# EAGLE design 27c322adapter_3_2 (EAGLE 7.5.0)
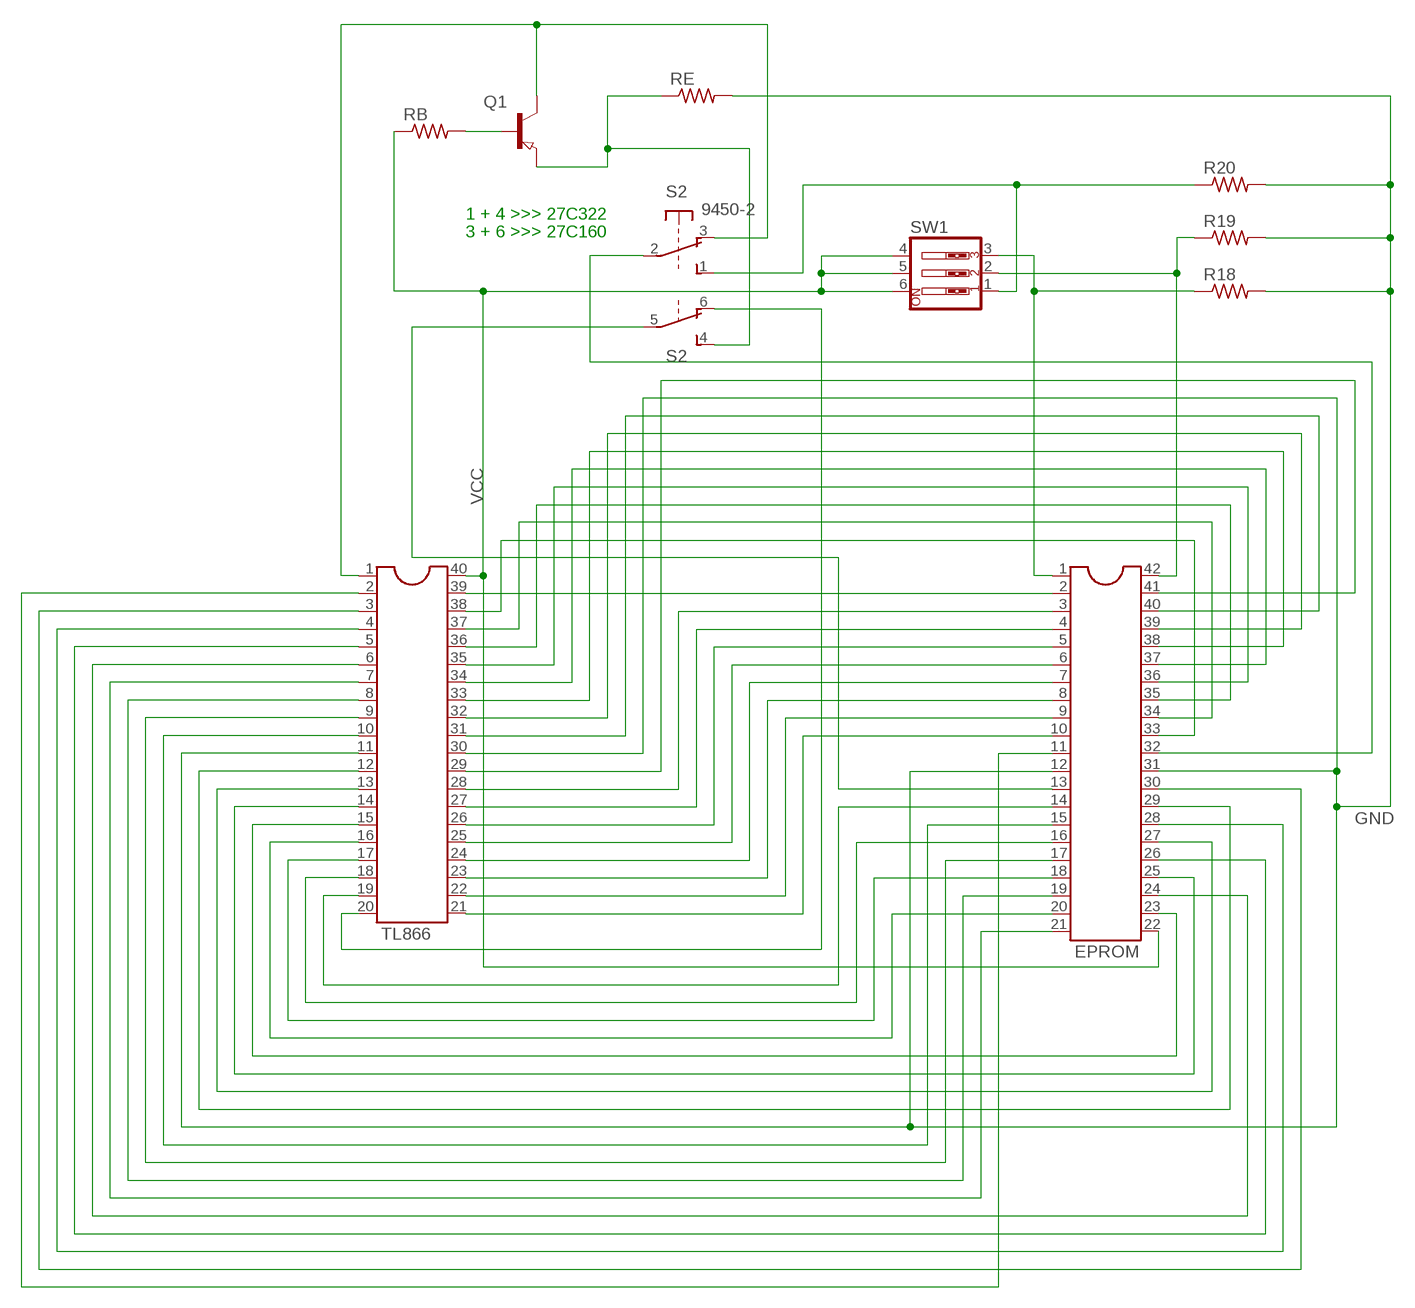
[diagram p0: schematic, sheet 1]

## Parts
IC1  EPROM  DIL42_SLIM  [DIL42_SLIM]
Q1  PNP-TRANSISTOR_SOT23  [SOT23]
R18  R-US_R0805  [R0805]
R19  R-US_R0805  [R0805]
R20  R-US_R0805  [R0805]
RB  R-US_R0805  [R0805]
RE  R-US_R0805  [R0805]
S2  9450-2  [9450-2]
SW1  SW_DIP-3  [EDG-03]
TL866  TL866  DIL40_SLIM  [DIL40_SLIM]

## Nets
GND: IC1.12 IC1.31 R18.2 R19.2 R20.2 RE.2 TL866.11 TL866.30
N$1: IC1.32 S2.2(1:P)
N$2: IC1.2 TL866.39
N$3: IC1.33 TL866.38
N$4: IC1.34 TL866.37
N$5: IC1.35 TL866.36
N$6: IC1.36 TL866.35
N$7: IC1.37 TL866.34
N$8: IC1.38 TL866.33
N$9: IC1.39 TL866.32
N$10: IC1.40 TL866.31
N$11: IC1.42 R19.1 SW1.2
N$12: IC1.41 TL866.29
N$13: IC1.3 TL866.28
N$14: IC1.4 TL866.27
N$15: IC1.5 TL866.26
N$16: IC1.6 TL866.25
N$17: IC1.7 TL866.24
N$18: IC1.8 TL866.23
N$19: IC1.9 TL866.22
N$20: IC1.10 TL866.21
N$21: S2.6(2:O) TL866.20
N$22: IC1.14 TL866.19
N$23: IC1.16 TL866.18
N$24: IC1.18 TL866.17
N$25: IC1.20 TL866.16
N$26: IC1.23 TL866.15
N$27: IC1.25 TL866.14
N$28: IC1.27 TL866.13
N$29: IC1.29 TL866.12
N$30: Q1.1(B) RB.2
N$31: IC1.15 TL866.10
N$32: IC1.17 TL866.9
N$33: IC1.19 TL866.8
N$34: IC1.21 TL866.7
N$35: IC1.24 TL866.6
N$36: IC1.26 TL866.5
N$37: IC1.28 TL866.4
N$38: IC1.30 TL866.3
N$39: IC1.11 TL866.2
N$40: Q1.3(C) S2.3(1:O) TL866.1
N$41: IC1.1 R18.1 SW1.3
N$42: IC1.13 S2.5(2:P)
N$44: R20.1 S2.1(1:S) SW1.1
N$46: Q1.2(E) RE.1 S2.4(2:S)
VCC: IC1.22 RB.1 SW1.4 SW1.5 SW1.6 TL866.40

## Notes on the sheet
- 1 + 4 >>> 27C322
- 3 + 6 >>> 27C160

## Library data of the parts
IC1 = ic-package:DIL42_SLIM: Dual In Line
Q1 = semicon-smd-ipc:PNP-TRANSISTOR_: PNP TRANSISTOR
R18-R20 RB RE = resistor:R-US_: RESISTOR, American symbol
S2 = switch-misc:9450-2: MARQUARDT SWITCH
SW1 = special:SW_DIP-3: DIP SWITCH
TL866 = ic-package:DIL40_SLIM: Dual In Line

## Board
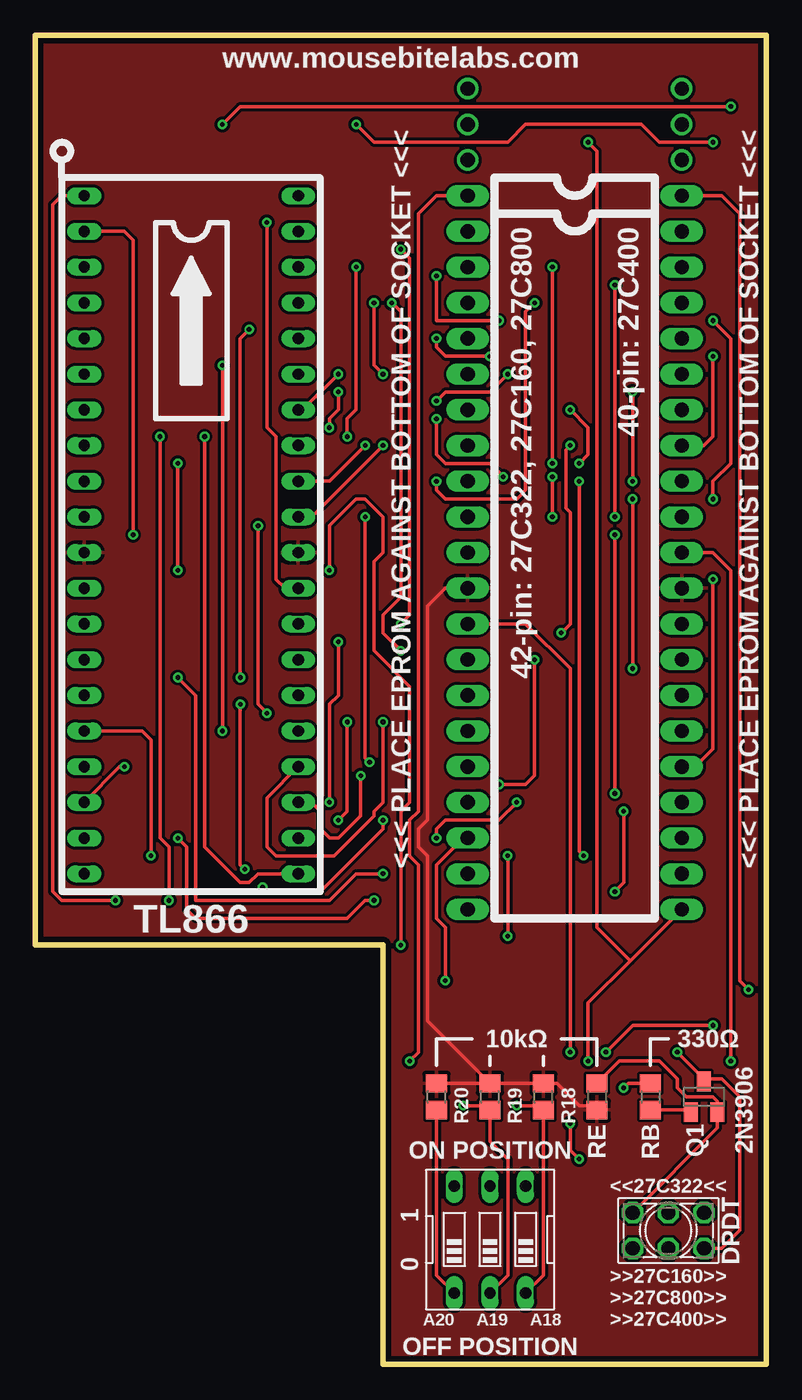
[diagram p1: board, top side]
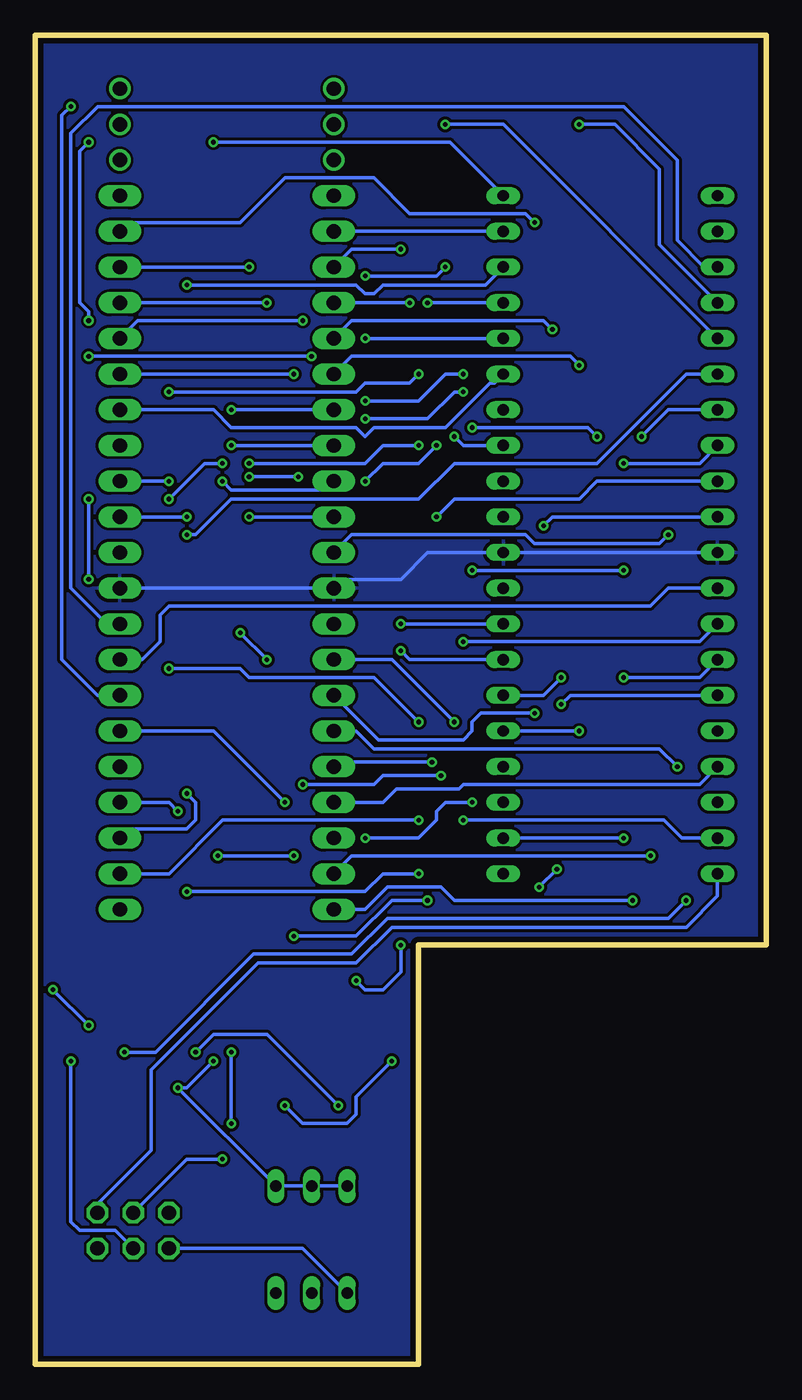
[diagram p2: board, bottom side, seen from below]

Size 52.07 x 94.61 mm. Coordinates in mm from the lower left corner, seen from the top.
Outline: 24.77,0 52.07,0 52.07,94.61 0,94.61 0,29.84 24.77,29.84 24.77,0
Copper layers (1*16): Top 0.0356mm / dielectric 1.5011mm / Bottom 0.0356mm
Design rules "jlcpcb *": minimum track width 10mil, minimum drill 13mil, track to track 8mil, track to pad 8mil, pad to pad 8mil, via to via 8mil, smd to smd 5mil, copper to edge 15mil, drill to drill 22mil, minimum pad ring 7mil, minimum via ring 7mil, stop-mask expansion 2.5mil, vias tented up to drill 13mil, thermal gap 10mil

### Footprints (pad centres in the part's own frame; a part is rotated, then mirrored left to right if it is on the bottom)
DIL42_SLIM = drill 1.016 long: 1 -25.4,-7.62; 2 -22.86,-7.62; 3 -20.32,-7.62; 4 -17.78,-7.62; 5 -15.24,-7.62; 6 -12.7,-7.62; 7 -10.16,-7.62; 8 -7.62,-7.62; 9 -5.08,-7.62; 10 -2.54,-7.62; 11 0,-7.62; 12 2.54,-7.62; 13 5.08,-7.62; 14 7.62,-7.62; 15 10.16,-7.62; 16 12.7,-7.62; 17 15.24,-7.62; 18 17.78,-7.62; 19 20.32,-7.62; 20 22.86,-7.62; 21 25.4,-7.62; 22 25.4,7.62; 23 22.86,7.62; 24 20.32,7.62; 25 17.78,7.62; 26 15.24,7.62; 27 12.7,7.62; 28 10.16,7.62; 29 7.62,7.62; 30 5.08,7.62; 31 2.54,7.62; 32 0,7.62; 33 -2.54,7.62; 34 -5.08,7.62; 35 -7.62,7.62; 36 -10.16,7.62; 37 -12.7,7.62; 38 -15.24,7.62; 39 -17.78,7.62; 40 -20.32,7.62; 41 -22.86,7.62; 42 -25.4,7.62 | drill 1.016 pad 1.016: P$1 -27.94,7.62; P$2 -30.48,7.62; P$3 -33.02,7.62; P$4 -33.02,-7.62; P$5 -30.48,-7.62; P$6 -27.94,-7.62
SOT23 = smd 1 x 1.4: 1 -0.95,-1.1; 2 0.95,-1.1; 3 0,1.1
R0805 = smd 1.3 x 1.5: 1 -0.95,0; 2 0.95,0
9450-2 = drill 1.016 octagon: 1 -2.54,-1.27; 2 0,-1.27; 3 2.54,-1.27; 4 -2.54,1.27; 5 0,1.27; 6 2.54,1.27
EDG-03 = drill 0.813 long: 1 -2.54,-3.81; 2 0,-3.81; 3 2.54,-3.81; 4 2.54,3.81; 5 0,3.81; 6 -2.54,3.81
DIL40_SLIM = drill 0.813 long: 1 -24.13,-7.62; 2 -21.59,-7.62; 3 -19.05,-7.62; 4 -16.51,-7.62; 5 -13.97,-7.62; 6 -11.43,-7.62; 7 -8.89,-7.62; 8 -6.35,-7.62; 9 -3.81,-7.62; 10 -1.27,-7.62; 11 1.27,-7.62; 12 3.81,-7.62; 13 6.35,-7.62; 14 8.89,-7.62; 15 11.43,-7.62; 16 13.97,-7.62; 17 16.51,-7.62; 18 19.05,-7.62; 19 21.59,-7.62; 20 24.13,-7.62; 21 24.13,7.62; 22 21.59,7.62; 23 19.05,7.62; 24 16.51,7.62; 25 13.97,7.62; 26 11.43,7.62; 27 8.89,7.62; 28 6.35,7.62; 29 3.81,7.62; 30 1.27,7.62; 31 -1.27,7.62; 32 -3.81,7.62; 33 -6.35,7.62; 34 -8.89,7.62; 35 -11.43,7.62; 36 -13.97,7.62; 37 -16.51,7.62; 38 -19.05,7.62; 39 -21.59,7.62; 40 -24.13,7.62

### Placement (x,y rotation side)
IC1  38.42,57.78 270 top
Q1  47.62,19.05 0 top
R18  36.2,19.05 90 top
R19  32.38,19.05 90 top
R20  28.57,19.05 90 top
RB  43.81,19.05 270 top
RE  40.01,19.05 270 top
S2  45.09,9.53 0 top
SW1  32.38,8.89 0 top
TL866  11.11,59.05 270 top

### Tracks (layer width: path | path; a pad name or v marks a point on that pad's centre or on a via)
GND
  Top 0.254: RE.2 39.69,18.41 38.73,18.41 37.15,20 R18.2 R19.2 | R19.2 R20.2 | R19.2 27.94,24.45 27.94,36.2 27.3,36.83 27.3,38.1 27.94,38.73 27.94,53.98 29.21,55.24 IC1.12
  Bottom 0.254: IC1.31 IC1.12 30.16,55.88 26.04,55.88 24.13,57.78 TL866.30 TL866.11
  pour Top: -3.17,100.33 -3.17,-5.08 55.88,-5.08 55.88,100.33
  pour Bottom: -15.88,102.87 -15.88,-14.6 71.75,-14.6 71.75,107.31 -15.88,107.31
N$1  (via drill 0.33)
  Top 0.254: v49.53,21.59 49.53,56.52 48.26,57.78 IC1.32
  Bottom 0.254: S2.2 46.36,9.53 48.9,9.53 49.53,10.16 v49.53,21.59
N$2
  Bottom 0.254: IC1.2 TL866.39
N$3  (via drill 0.33)
  Top 0.254: v41.27,76.83 v41.27,60.32
  Bottom 0.254: TL866.38 20,76.83 27.3,76.83 27.94,76.2 28.57,76.2 29.21,76.83 v41.27,76.83 | v41.27,60.32 IC1.33
N$4  (via drill 0.33)
  Top 0.254: v42.55,69.22 v42.55,62.86 | v24.77,70.48 24.13,71.12 v24.13,75.56
  Bottom 0.254: v24.77,70.48 25.4,69.85 28.57,69.85 29.21,69.22 v42.55,69.22 | v42.55,62.86 IC1.34 | v24.13,75.56 TL866.37
N$5  (via drill 0.33)
  Top 0.254: v28.57,73.02 28.57,72.39 29.21,71.75 v32.38,71.75 | v48.26,71.75 48.26,66.04 47.62,65.41 IC1.35
  Bottom 0.254: TL866.36 v28.57,73.02 | v32.38,71.75 v48.26,71.75
N$6
  Bottom 0.254: TL866.35 19.37,69.85 19.69,69.85 22.86,66.67 27.94,66.67 28.57,66.04 29.21,66.67 38.1,66.67 39.37,67.95 IC1.36
N$7  (via drill 0.33)
  Top 0.254: v33.66,70.48 32.38,69.22 29.21,69.22 v28.57,68.58 | v21.59,70.48 19.05,67.95 TL866.34
  Bottom 0.254: IC1.37 v33.66,70.48 | v28.57,68.58 24.77,68.58 22.86,70.48 v21.59,70.48
N$8  (via drill 0.33)
  Top 0.254: v33.02,74.3 28.57,74.3 v28.57,77.47 | v22.86,78.11 22.86,67.95 22.23,67.31 v22.23,66.04
  Bottom 0.254: IC1.38 44.77,74.3 v33.02,74.3 | v28.57,77.47 23.5,77.47 v22.86,78.11 | v22.23,66.04 21.59,65.41 TL866.33
N$9  (via drill 0.33)
  Top 0.254: v35.56,75.56 34.93,74.93 34.93,62.23 34.29,61.59 29.21,61.59 28.57,62.23 v28.57,62.86 | v23.5,65.41 20.96,62.86 TL866.32
  Bottom 0.254: IC1.39 v35.56,75.56 | v28.57,62.86 27.3,64.14 24.77,64.14 v23.5,65.41
N$10  (via drill 0.33)
  Top 0.254: v36.83,78.11 v36.83,64.14 | v24.77,65.41 19.69,60.32 TL866.31
  Bottom 0.254: IC1.40 v36.83,78.11 | v36.83,64.14 28.57,64.14 27.3,65.41 v24.77,65.41
N$11  (via drill 0.33)
  Top 0.254: SW1.2 33.66,6.35 33.66,14.61 32.38,15.88 R19.1 32.07,18.41 v30.48,18.41 | v40.64,22.23 42.55,24.13 v48.26,24.13 | v50.8,26.67 50.16,27.3 50.16,81.91 48.9,83.19 IC1.42
  Bottom 0.254: v30.48,18.41 35.56,23.49 39.37,23.49 v40.64,22.23 | v48.26,24.13 v50.8,26.67
N$12  (via drill 0.33)
  Top 0.254: v16.51,81.28 16.51,66.67 17.14,66.04 17.14,55.88 17.78,55.24 TL866.29
  Bottom 0.254: IC1.41 45.4,81.28 37.47,81.28 34.29,84.45 27.94,84.45 25.4,81.91 17.14,81.91 v16.51,81.28
N$13  (via drill 0.33)
  Top 0.254: v26.04,79.38 26.67,78.74 26.67,53.34 v26.04,52.7
  Bottom 0.254: IC1.3 29.53,79.38 v26.04,79.38 | v26.04,52.7 TL866.28
N$14  (via drill 0.33)
  Top 0.254: v25.4,75.56 26.04,74.93 26.04,54.61 24.77,53.34 24.77,52.07 v26.04,50.8
  Bottom 0.254: IC1.4 v25.4,75.56 | v26.04,50.8 25.4,50.16 TL866.27
N$15  (via drill 0.33)
  Top 0.254: v15.24,73.66 14.61,73.02 v14.61,48.89
  Bottom 0.254: IC1.5 29.53,74.3 15.88,74.3 v15.24,73.66 | v14.61,48.89 15.88,47.62 TL866.26
N$16  (via drill 0.33)
  Top 0.254: v13.34,71.12 v13.34,45.09
  Bottom 0.254: IC1.6 29.53,71.75 13.97,71.75 v13.34,71.12 | v13.34,45.09 TL866.25
N$17  (via drill 0.33)
  Top 0.254: v38.1,67.95 39.37,66.67 39.37,64.77 v38.73,64.14 | v42.55,61.59 v42.55,49.53 | v24.77,45.72 24.77,40 24.13,39.37 24.13,39.05 21.27,36.2 17.14,36.2 16.51,36.83 16.51,40.32 TL866.24
  Bottom 0.254: IC1.7 v38.1,67.95 | v38.73,64.14 40.01,64.14 v42.55,61.59 | v42.55,49.53 37.47,49.53 36.83,48.89 27.94,48.89 v24.77,45.72
N$18  (via drill 0.33)
  Top 0.254: v38.1,65.41 37.78,65.09 37.78,60.96 38.1,60.64 38.1,52.7 v37.47,52.07 | v35.56,50.16 35.56,41.91 34.93,41.27 v33.02,41.27 | v23.18,41.91 23.18,39.05 21.59,37.46 20.96,37.46 20.32,38.1 20.32,39.37 19.69,40 TL866.23
  Bottom 0.254: IC1.8 v38.1,65.41 | v37.47,52.07 v35.56,50.16 | v33.02,41.27 27.94,41.27 27.3,41.91 v23.18,41.91
N$19  (via drill 0.33)
  Top 0.254: v10.16,37.46 10.8,36.83 10.8,32.38 11.43,31.75 22.23,31.75 23.5,33.02 v24.13,33.02 | v33.66,30.48 v33.66,36.2 | v39.05,36.2 38.73,36.51 v38.73,62.86
  Bottom 0.254: IC1.9 31.43,62.23 38.1,62.23 v38.73,62.86 | v39.05,36.2 v33.66,36.2 | TL866.22 v10.16,37.46 | v24.13,33.02 26.67,33.02 29.21,30.48 v33.66,30.48
N$20  (via drill 0.33)
  Top 0.254: v12.07,66.04 12.07,36.83 14.61,34.29 15.24,34.29 15.88,34.92 TL866.21 | v20.96,66.67 20.96,67.31 21.59,67.95 v21.59,69.22 | v28.57,67.31 28.57,64.77 29.21,64.14 32.38,64.14 v33.34,63.18 | v36.83,63.18 v36.83,60.32
  Bottom 0.254: v12.07,66.04 12.7,66.67 v20.96,66.67 | v21.59,69.22 22.23,69.22 24.13,67.31 v28.57,67.31 | v33.34,63.18 v36.83,63.18 | v36.83,60.32 IC1.10
N$21
  Bottom 0.254: TL866.20 3.49,33.34 5.72,31.12 26.67,31.12 29.21,28.58 36.2,28.58 43.81,20.95 43.81,15.24 47.62,11.43 S2.6
N$22  (via drill 0.33)
  Top 0.254: v21.59,38.73 22.23,39.37 v22.23,45.72
  Bottom 0.254: v21.59,38.73 7.3,38.73 6.03,37.46 TL866.19 | v22.23,45.72 26.67,50.16 IC1.14
N$23  (via drill 0.33)
  Top 0.254: TL866.18 6.03,42.55 v6.35,42.55
  Bottom 0.254: v6.35,42.55 7.62,43.81 27.94,43.81 29.21,45.09 IC1.16
N$24
  Bottom 0.254: TL866.17 4.76,41.27 21.59,41.27 21.91,40.96 26.35,40.96 27.3,40 IC1.18
N$25  (via drill 0.33)
  Top 0.254: v8.25,36.2 8.25,44.45 7.62,45.09 TL866.16
  Bottom 0.254: IC1.20 29.53,36.2 v8.25,36.2
N$26  (via drill 0.33)
  Top 0.254: v16.19,33.97 16.51,33.66 20.32,33.66 24.77,38.1 v24.77,38.73 | v14.92,35.24 14.61,35.56 v14.61,46.99
  Bottom 0.254: IC1.23 42.55,34.92 38.73,38.73 v24.77,38.73 | v14.61,46.99 13.97,47.62 TL866.15 | v14.92,35.24 v16.19,33.97
N$27  (via drill 0.33)
  Top 0.254: v10.16,48.89 11.43,47.62 11.43,33.02 20.96,33.02 22.86,34.92 v24.77,34.92 | v41.27,33.66 41.91,34.29 v41.91,39.37
  Bottom 0.254: TL866.14 4.76,48.89 v10.16,48.89 | v24.77,34.92 27.3,34.92 28.57,33.66 v41.27,33.66 | v41.91,39.37 42.55,40 IC1.25
N$28  (via drill 0.33)
  Top 0.254: v21.59,51.43 21.59,47.62 20.96,46.99 v20.96,40 | v28.57,37.46 28.57,38.1 29.21,38.73 33.02,38.73 v34.29,40
  Bottom 0.254: TL866.13 4.76,51.43 v21.59,51.43 | v20.96,40 22.86,40 23.5,39.37 23.5,38.73 24.77,37.46 v28.57,37.46 | v34.29,40 39.37,45.09 IC1.27
N$29
  Bottom 0.254: TL866.12 6.99,55.24 8.25,53.98 42.55,53.98 43.18,53.34 43.18,51.43 44.45,50.16 IC1.29
N$30
  Top 0.254: Q1.1 46.52,18.1 RB.2
N$31  (via drill 0.33)
  Top 0.254: v16.51,46.35 15.88,46.99 v15.88,59.69
  Bottom 0.254: IC1.15 27.62,44.45 21.59,44.45 20.96,45.09 20.96,45.72 20.32,46.35 v16.51,46.35 | v15.88,59.69 15.24,60.32 TL866.10
N$32  (via drill 0.33)
  Top 0.254: v23.81,42.86 23.5,43.18 v23.5,60.32
  Bottom 0.254: v23.5,60.32 22.23,61.59 13.34,61.59 12.07,62.86 TL866.9 | v23.81,42.86 30.48,42.86 IC1.17
N$33  (via drill 0.33)
  Top 0.254: IC1.19 30.48,37.46 28.57,35.56 28.57,31.75 29.21,31.12 v29.21,27.3 | v26.04,29.84 26.04,39.37 26.67,40 26.67,48.26 24.13,50.8 24.13,57.15 24.77,57.78 24.77,60.32 23.5,61.59 22.86,61.59 20.96,59.69 v20.96,56.52 | v10.16,56.52 v10.16,64.14
  Bottom 0.254: v29.21,27.3 28.57,26.67 27.3,26.67 26.04,27.94 v26.04,29.84 | v20.96,56.52 v10.16,56.52 | v10.16,64.14 4.76,64.14 TL866.8
N$34  (via drill 0.33)
  Top 0.254: v9.52,33.02 9.52,36.83 8.89,37.46 v8.89,66.04
  Bottom 0.254: v8.89,66.04 6.99,67.95 TL866.7 | IC1.21 28.57,32.38 26.99,33.97 23.18,33.97 22.23,33.02 v9.52,33.02
N$35  (via drill 0.33)
  Top 0.254: v41.27,40.64 v41.27,59.05
  Bottom 0.254: IC1.24 45.4,38.1 41.27,38.1 40.64,38.73 40.64,40 v41.27,40.64 | v41.27,59.05 40.64,59.05 38.1,61.59 24.77,61.59 22.23,64.14 12.07,64.14 5.72,70.48 TL866.6
N$36  (via drill 0.33)
  Top 0.254: v22.86,88.27 24.13,87 33.66,87 34.93,88.27 43.18,88.27 44.45,87 v48.26,87 | v48.26,74.3 49.53,73.02 49.53,64.14 48.26,62.86 v48.26,61.59 | v48.26,55.88 48.26,43.81 46.99,42.55 IC1.26
  Bottom 0.254: TL866.5 18.73,88.27 v22.86,88.27 | v48.26,87 48.9,86.36 48.9,75.56 48.26,74.93 v48.26,74.3 | v48.26,61.59 v48.26,55.88
N$37  (via drill 0.33)
  Top 0.254: v13.34,88.27 14.61,89.53 v49.53,89.53
  Bottom 0.254: TL866.4 7.62,79.69 7.62,85.09 10.8,88.27 v13.34,88.27 | v49.53,89.53 50.16,88.9 50.16,50.16 47.62,47.62 IC1.28
N$38
  Bottom 0.254: IC1.30 46.99,52.7 49.53,55.24 49.53,87.63 47.62,89.53 10.16,89.53 6.35,85.72 6.35,80.01 4.45,78.11 TL866.3
N$39  (via drill 0.33)
  Top 0.254: v6.99,59.05 6.99,80.01 6.35,80.64 TL866.2
  Bottom 0.254: IC1.11 29.53,59.05 17.14,59.05 16.51,58.42 7.62,58.42 v6.99,59.05
N$40  (via drill 0.33)
  Top 0.254: S2.3 48.9,8.25 50.16,9.53 50.16,19.05 48.9,20.32 47.8,20.32 Q1.3 47.62,20.32 v45.72,22.23 | v5.72,33.02 1.91,33.02 1.27,33.66 1.27,82.55 1.91,83.19 TL866.1
  Bottom 0.254: v45.72,22.23 43.5,22.23 36.51,29.21 29.53,29.21 26.99,31.75 6.99,31.75 v5.72,33.02
N$41  (via drill 0.33)
  Top 0.254: SW1.3 36.2,6.35 R18.1 35.88,18.41 v34.29,18.41 | v26.67,21.59 27.3,22.23 27.3,35.56 26.67,36.2 26.67,38.73 27.3,39.37 27.3,81.91 28.57,83.19 IC1.1
  Bottom 0.254: v34.29,18.41 33.02,17.14 29.84,17.14 29.21,17.78 29.21,19.05 v26.67,21.59
N$42  (via drill 0.33)
  Top 0.254: v38.73,14.61 38.1,15.24 v38.1,17.14 | v38.1,22.23 38.1,49.53 34.93,52.7 IC1.13
  Bottom 0.254: S2.5 41.27,14.61 v38.73,14.61 | v38.1,17.14 v38.1,22.23
N$44
  Top 0.254: SW1.1 28.57,6.35 R20.1
  Bottom 0.254: SW1.1 33.02,8.25 S2.1
N$46
  Top 0.254: S2.4 48.58,16.82 Q1.2 48.58,18.73 48.26,19.05 46.36,19.05 45.72,19.69 45.72,20.32 44.45,21.59 41.59,21.59 RE.1
VCC  (via drill 0.33)
  Top 0.254: v41.91,19.69 42.23,20 RB.1 | IC1.22 42.39,28.73 | 42.39,28.73 39.37,25.72 v39.37,21.59 | v39.37,87 40.01,86.36 40.01,31.12 42.39,28.73
  Bottom 0.254: SW1.6 SW1.5 SW1.4 v41.91,19.69 41.27,19.69 v39.37,21.59 | TL866.40 22.54,87 v39.37,87

### Text on the board
tPlace: www.mousebitelabs.com | 42-pin: 27C322, 27C160, 27C800 | 40-pin: 27C400 | <<< PLACE EPROM AGAINST BOTTOM OF SOCKET <<< | <<< PLACE EPROM AGAINST BOTTOM OF SOCKET <<< | TL866 | 10kΩ | 330Ω | 2N3906 | ON POSITION | <<27C322<< | 0 1 | DPDT | >>27C160>> / >>27C800>> / >>27C400>> | A20 | A19 | A18 | OFF POSITION
tStop: v3.2